# Altium schematic sheet C40_IMB_2nd level_block_diagram.SchDoc: C40 IMB BLOCK DIAGRAM 2
size 812 x 571 mm; DocumentNumber: 3; SheetNumber: 3; SheetTotal: 7; PageSetup: Record=PageOptions|CenterHorizontal=True|CenterVertical=True|PrintScale=0.48|XCorrection=1.00|YCorrection=1.00|PrintKind=0|BorderSize=5000000|LeftOffset=0|BottomOffset=0|Orientation=2|PaperLength=1000|PaperWidth=1000|Scale=100|PaperSource=15|PrintQuality=1200|MediaType=1|DitherType=10|PaperKind=11 x 17|PrintScaleMode=1
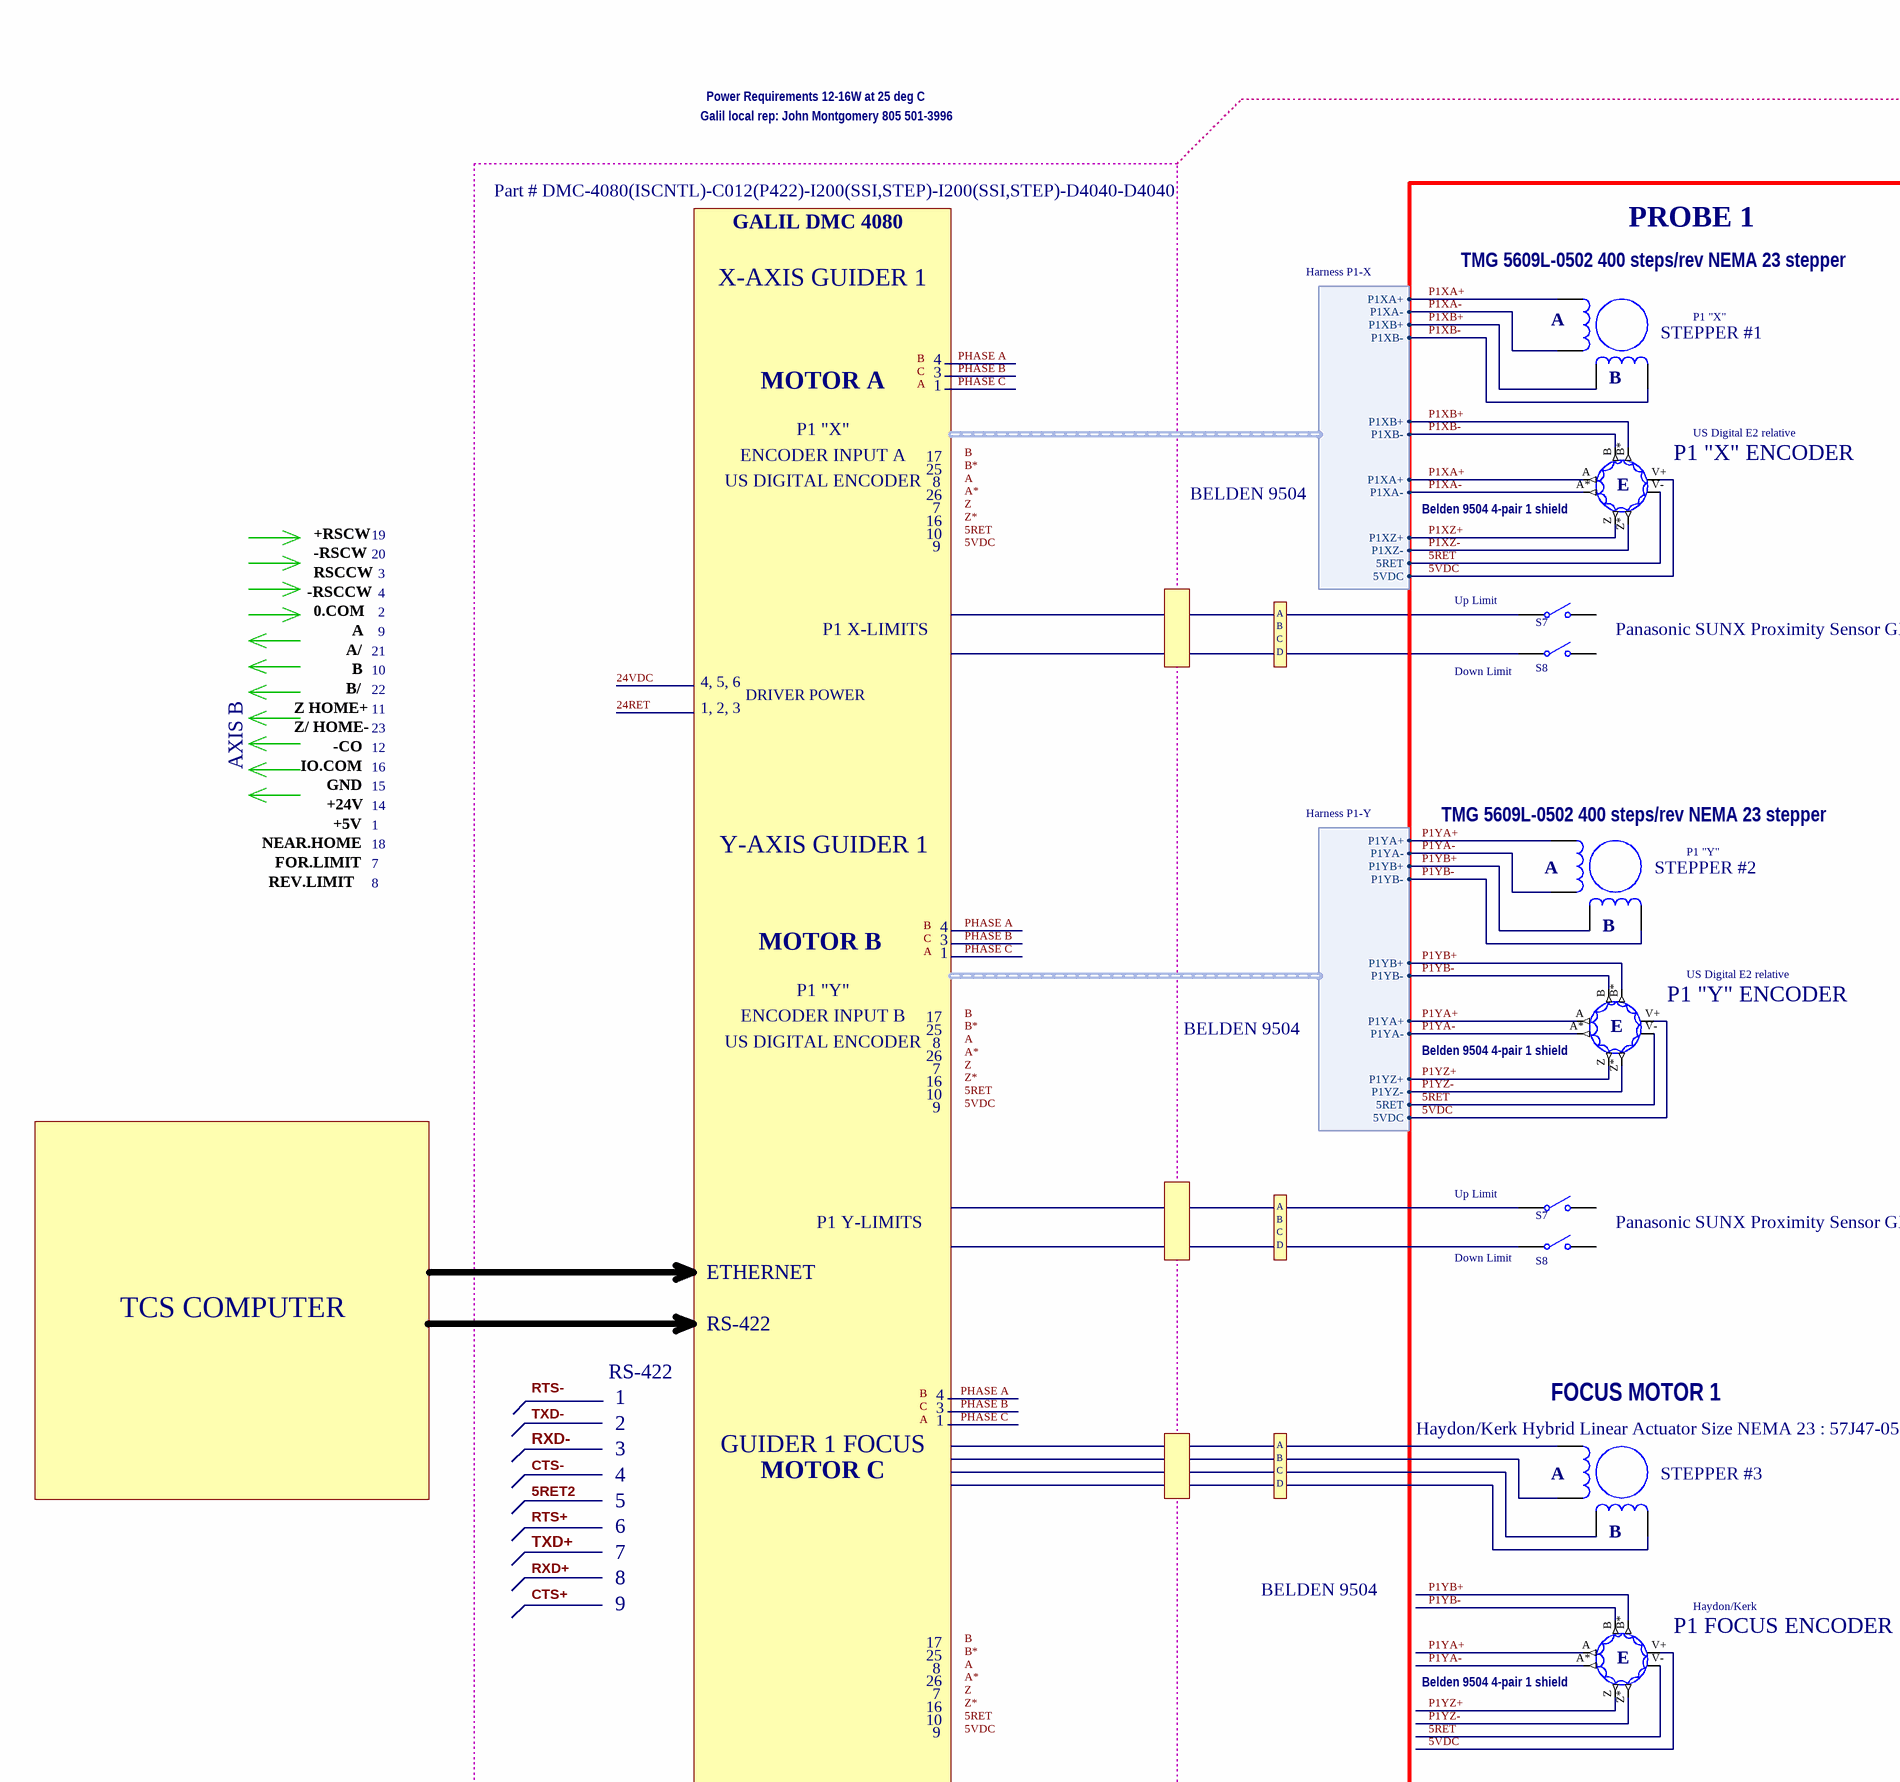
[diagram p0: C40_IMB_2nd level_block_diagram.SchDoc, top left]
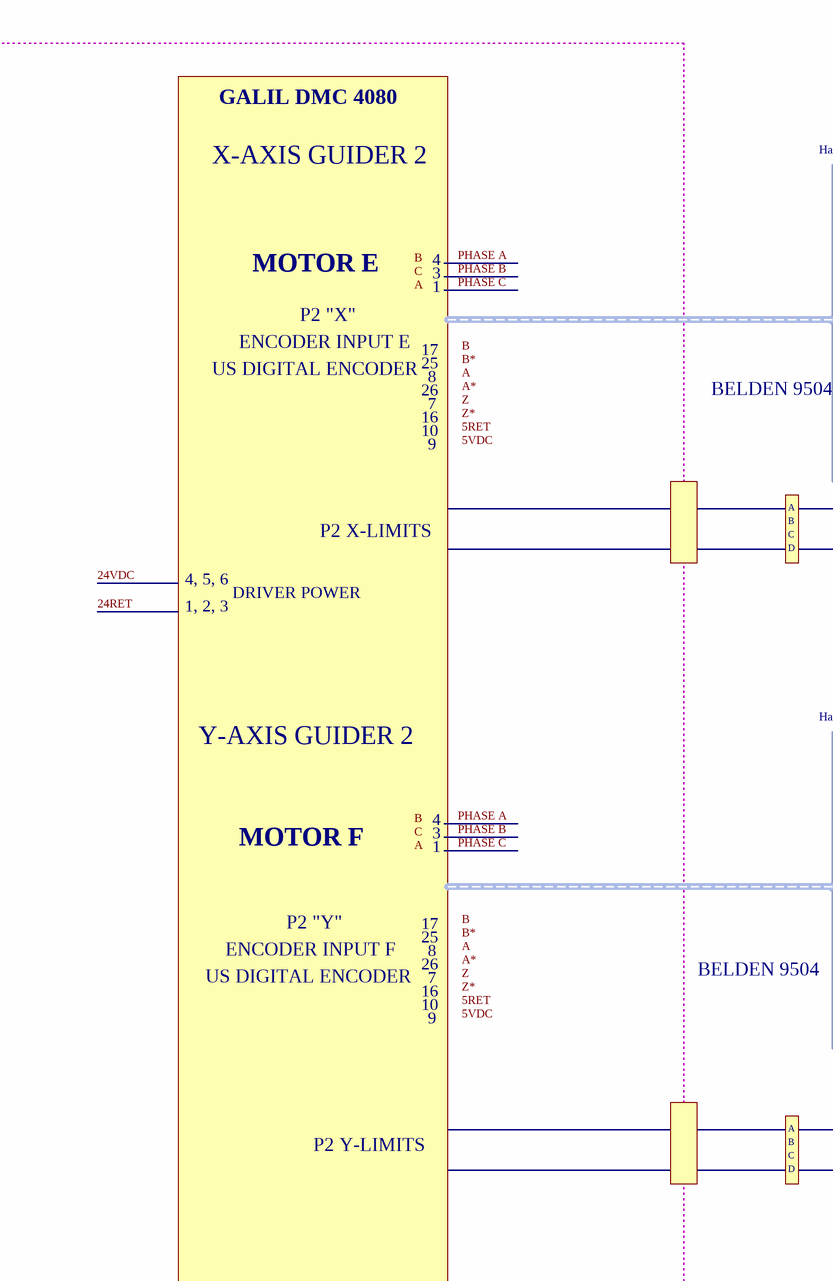
[diagram p1: C40_IMB_2nd level_block_diagram.SchDoc, top middle]
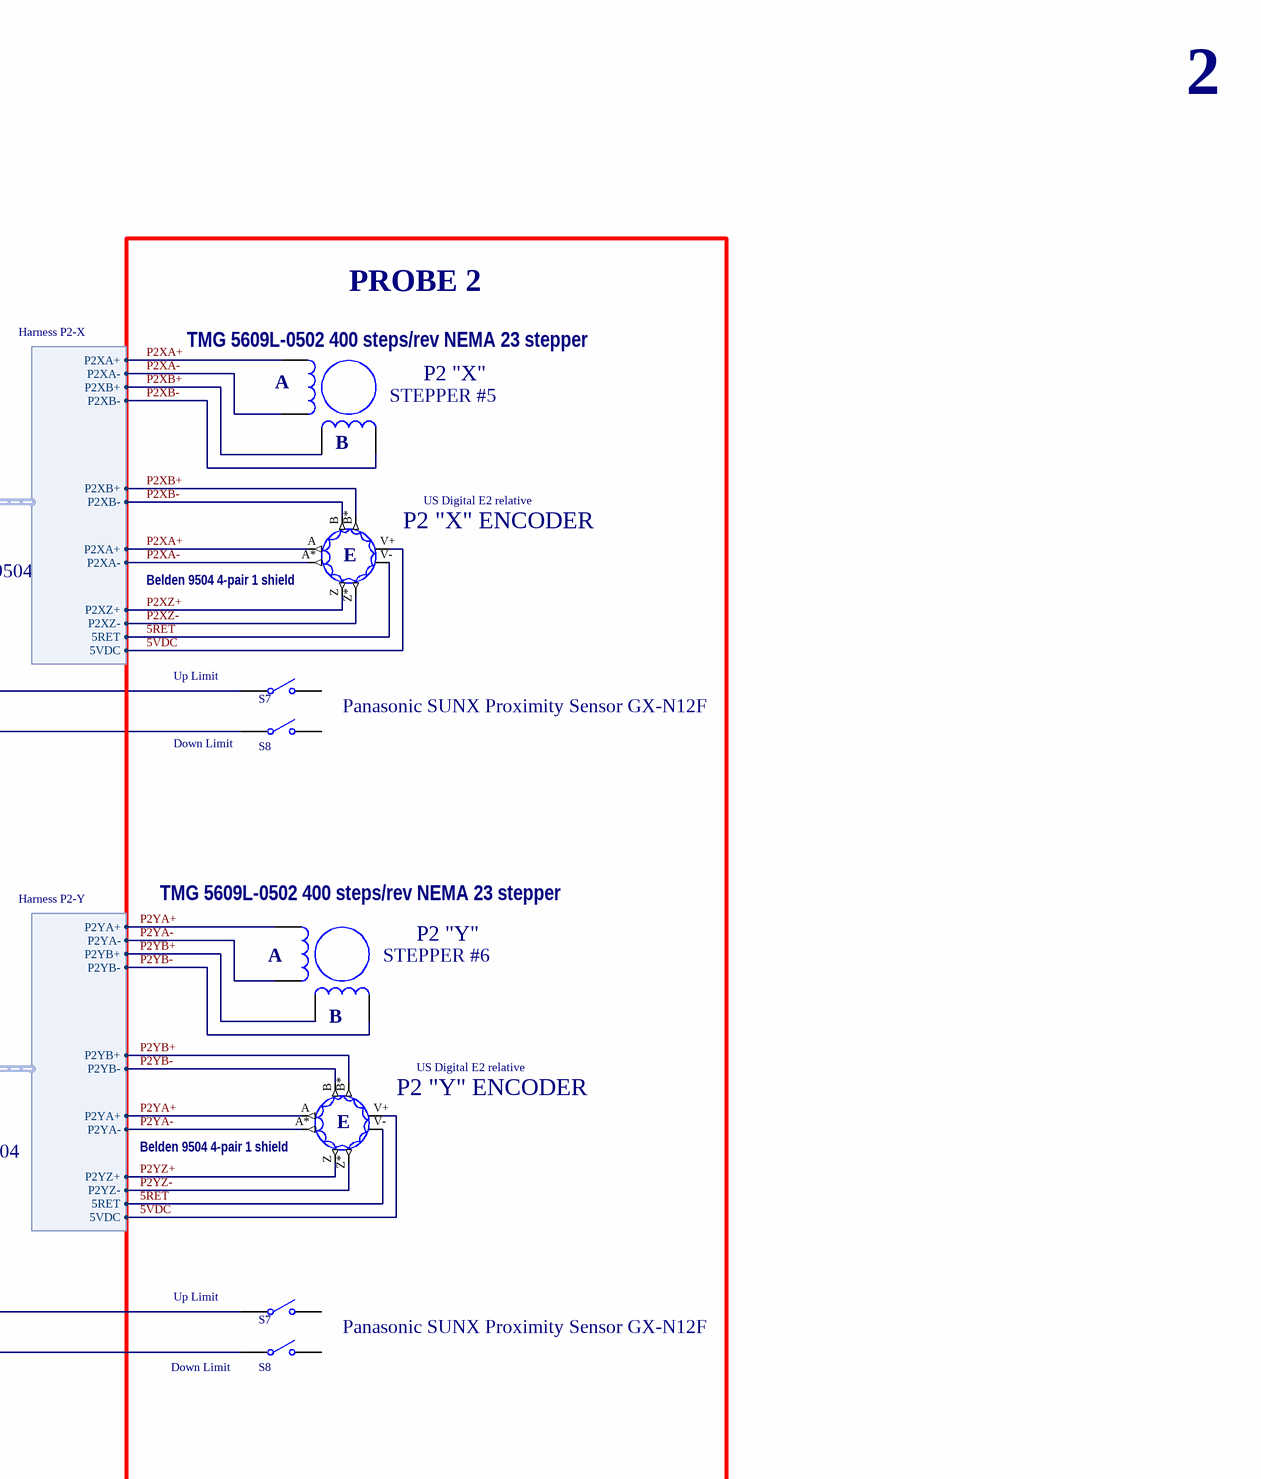
[diagram p2: C40_IMB_2nd level_block_diagram.SchDoc, top right]
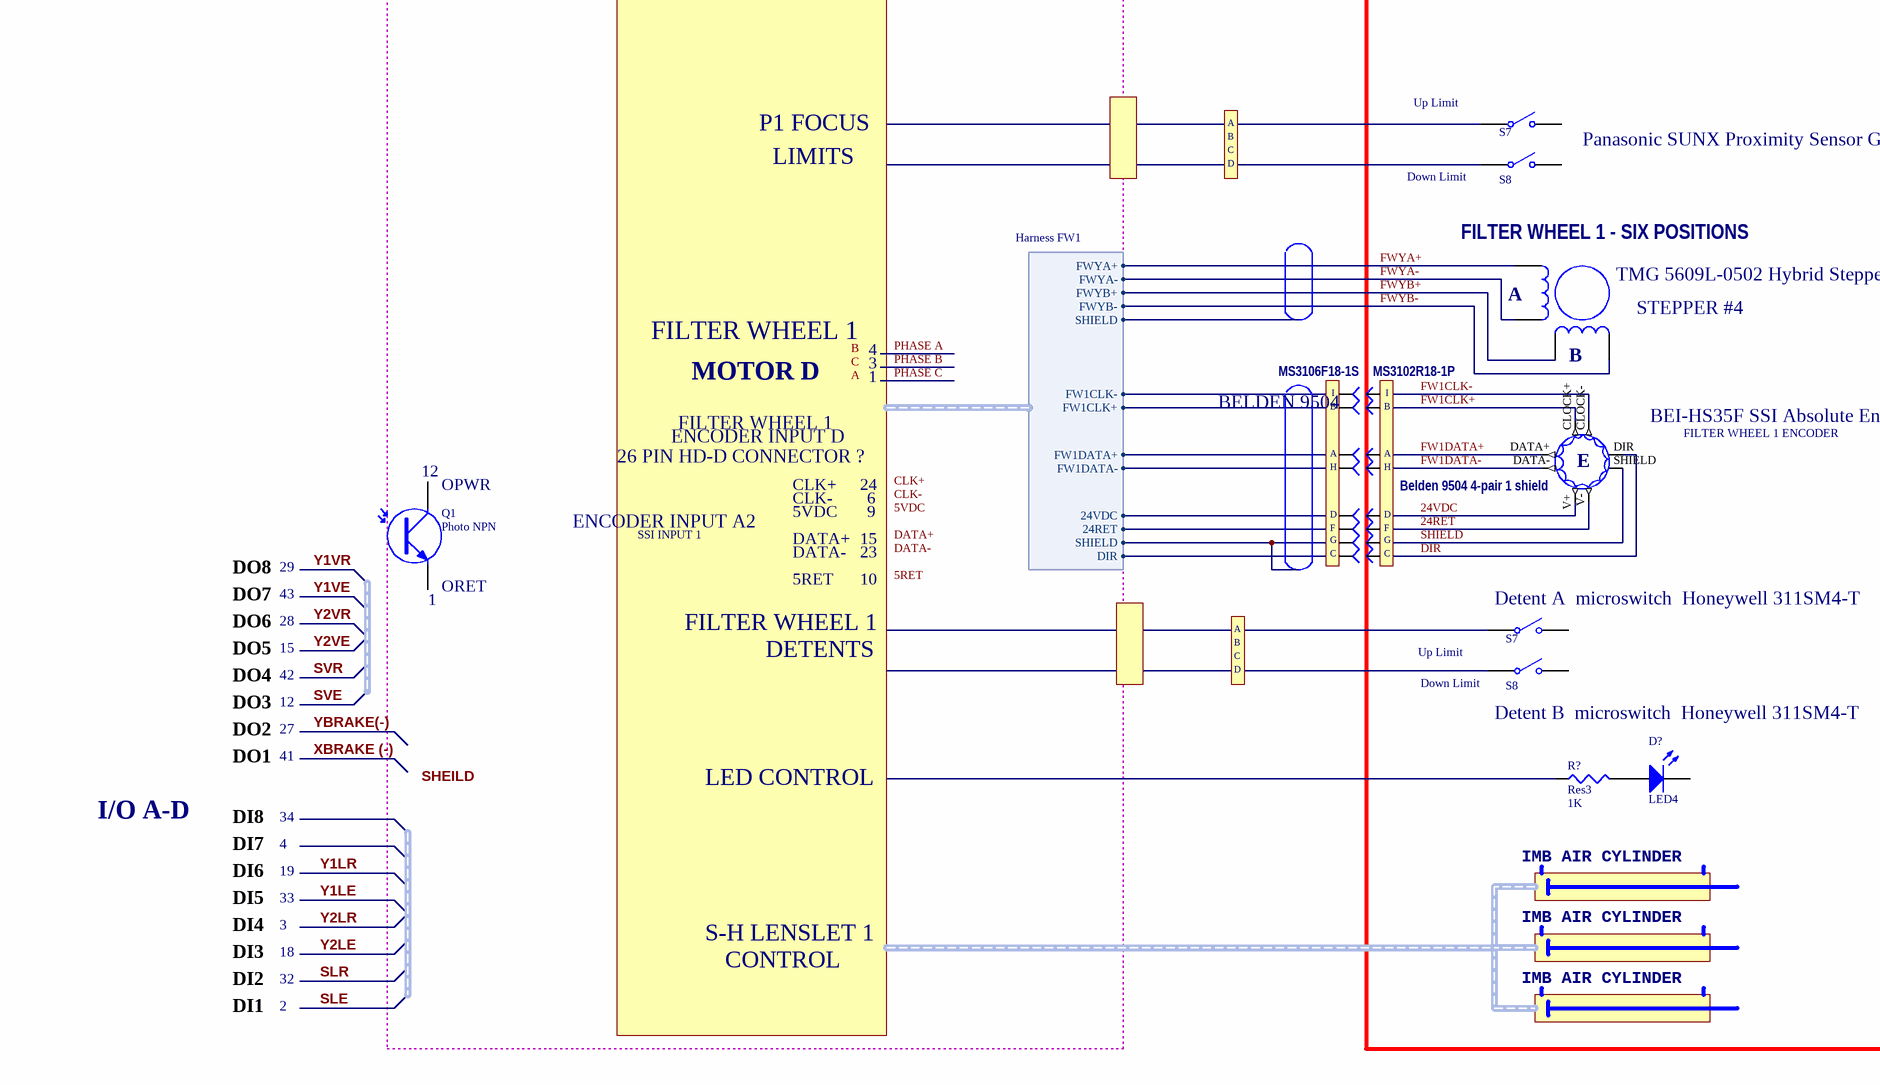
[diagram p3: C40_IMB_2nd level_block_diagram.SchDoc, bottom left]
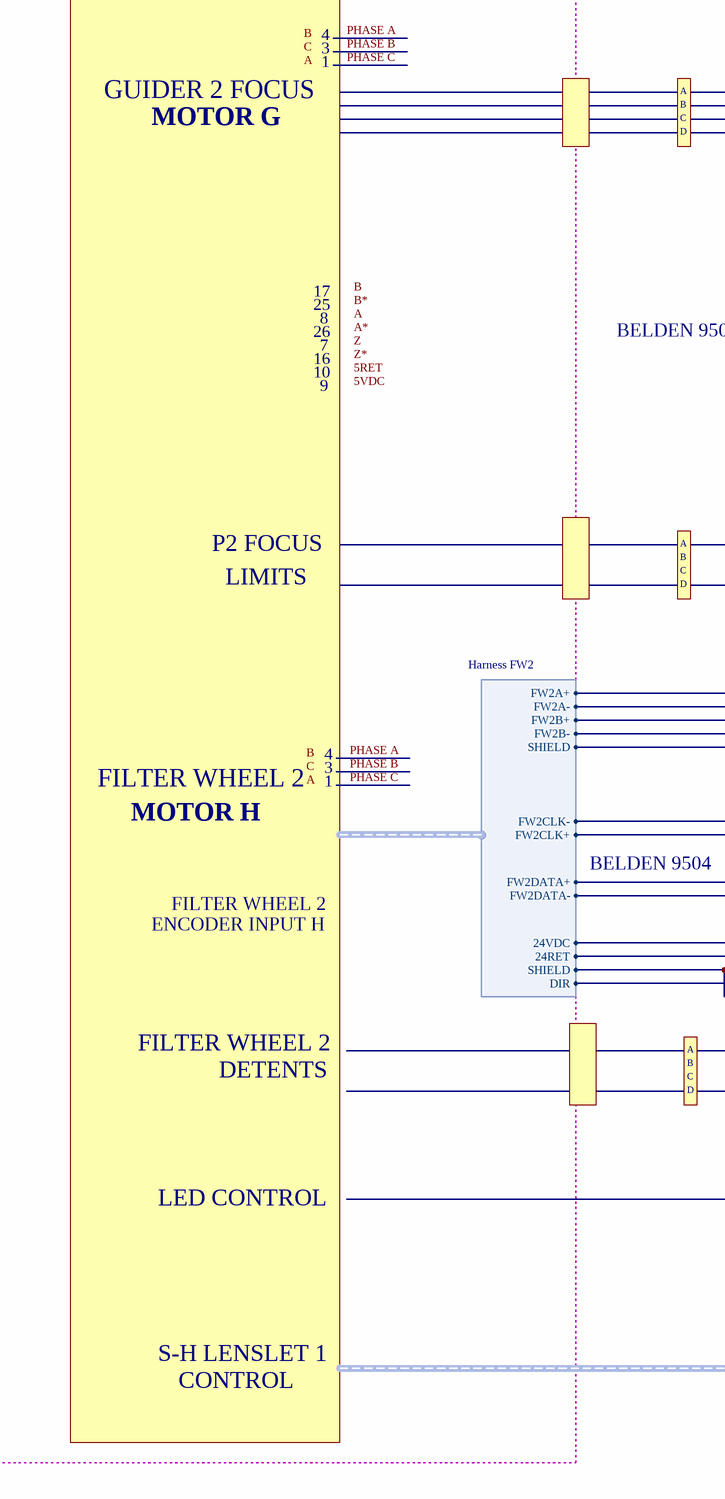
[diagram p4: C40_IMB_2nd level_block_diagram.SchDoc, bottom middle]
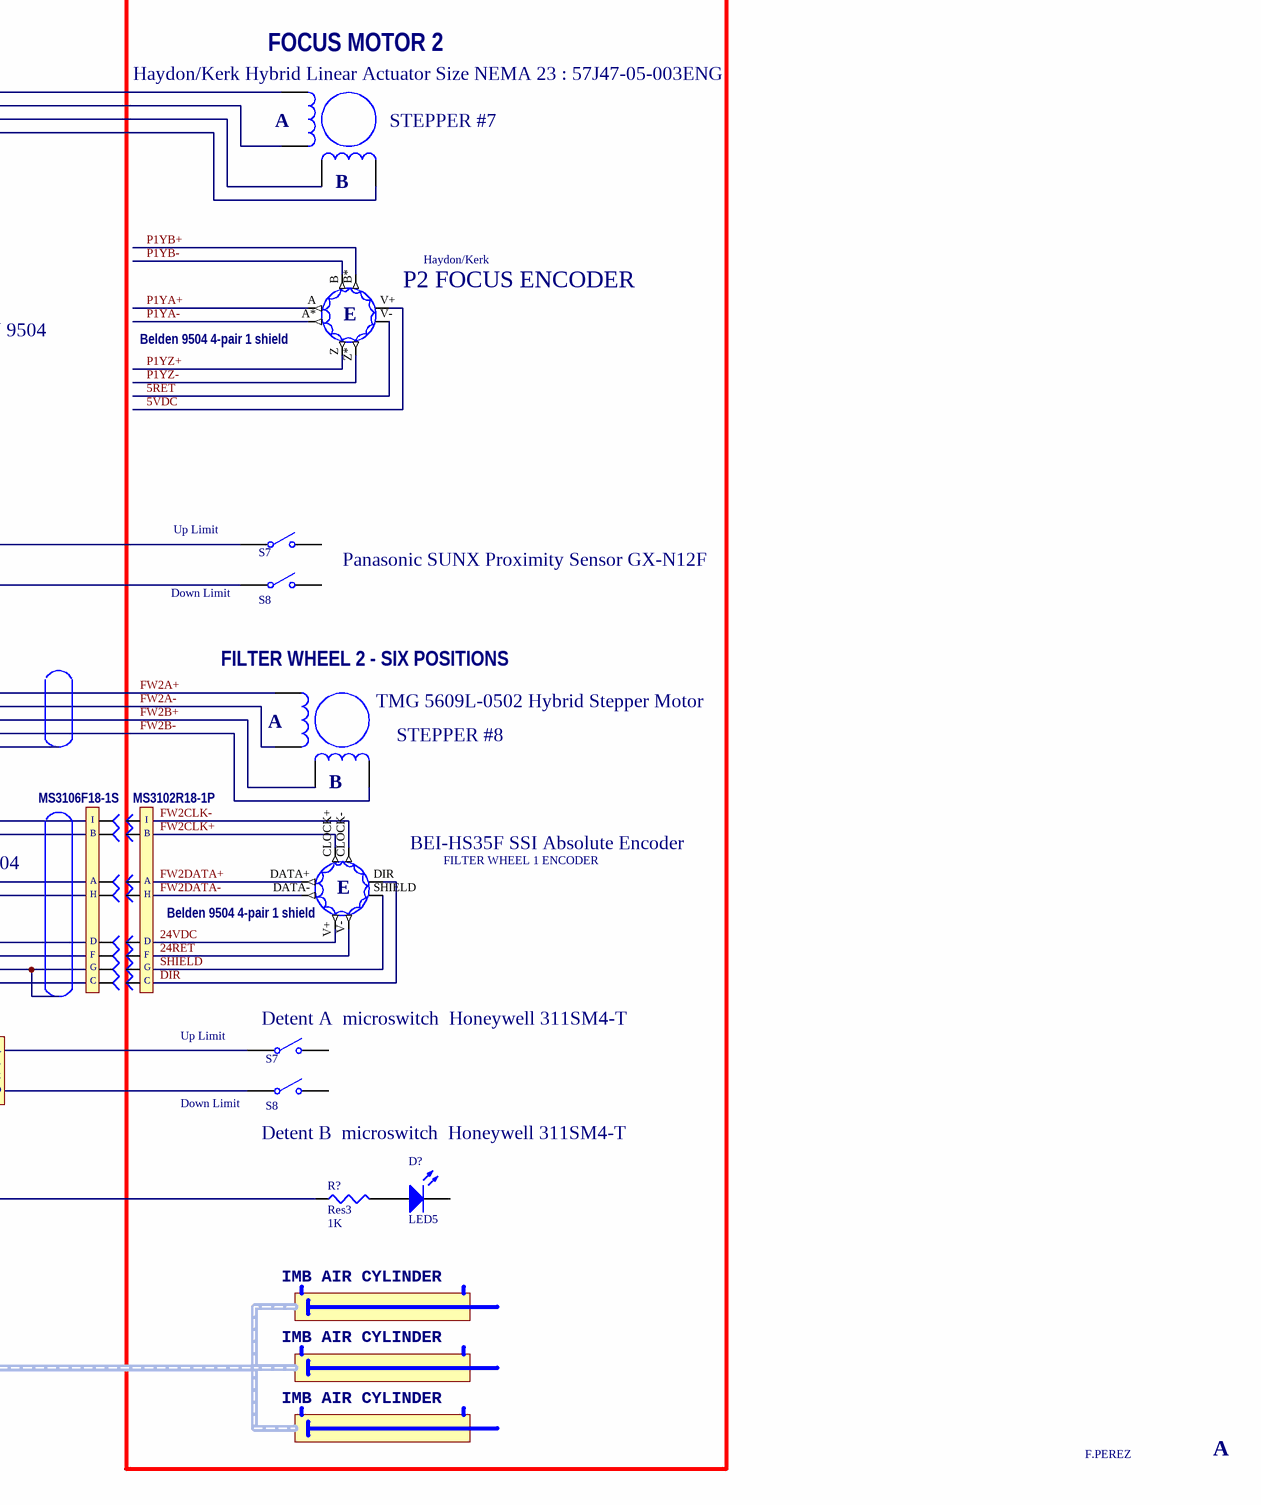
[diagram p5: C40_IMB_2nd level_block_diagram.SchDoc, bottom right]

## Parts
(Parts that share a designator on the sheet are numbered #1, #2 ... from top to bottom, then left to right.)
?#1  (no value)
?#2  (no value)
?#3  (no value)
?#4  (no value)
?#5  (no value)
?#6  (no value)
?#7  (no value)
?#8  (no value)
?#9  (no value)
?#10  (no value)
?#11  (no value)
?#12  (no value)
?#13  (no value)
?#14  (no value)
?#15  (no value)
?#16  (no value)
B#1  (no value)
B#2  (no value)
B#3  (no value)
B#4  (no value)
B#5  (no value)
B#6  (no value)
B#7  (no value)
B#8  (no value)
B#9  (no value)
B#10  (no value)
B#11  (no value)
B#12  (no value)
B#13  (no value)
B#14  (no value)
B#15  (no value)
B#16  (no value)
BEI-HS35F_SSI_Absolute_Encoder#1  FILTER WHEEL 1 ENCODER
BEI-HS35F_SSI_Absolute_Encoder#2  FILTER WHEEL 1 ENCODER
D?#1  LED4  [LED-1]
D?#2  LED5  [LED-1]
Haydon/Kerk#1  P1 FOCUS ENCODER
Haydon/Kerk#2  P2 FOCUS ENCODER
Haydon/Kerk_Hybrid_Linear_Actuator_Size_NEMA_23_:_57J47-05-003ENG#1  STEPPER #3
Haydon/Kerk_Hybrid_Linear_Actuator_Size_NEMA_23_:_57J47-05-003ENG#2  STEPPER #7
IMB_AIR_CYLINDER#1  (no value)
IMB_AIR_CYLINDER#2  (no value)
IMB_AIR_CYLINDER#3  (no value)
IMB_AIR_CYLINDER#4  (no value)
IMB_AIR_CYLINDER#5  (no value)
IMB_AIR_CYLINDER#6  (no value)
P1_"X"  STEPPER #1
P1_"Y"  STEPPER #2
P2_"X"  STEPPER #5
P2_"Y"  STEPPER #6
Q1  Photo NPN  [SFM-T2(3)/X1.6V]
R?#1  Res3  value 1K  [J1-0603]
R?#2  Res3  value 1K  [J1-0603]
S7#1  Up Limit  [SPST-2]
S7#2  Up Limit  [SPST-2]
S7#3  Up Limit  [SPST-2]
S7#4  Up Limit  [SPST-2]
S7#5  Up Limit  [SPST-2]
S7#6  Up Limit  [SPST-2]
S7#7  Up Limit  [SPST-2]
S7#8  Up Limit  [SPST-2]
S8#1  Down Limit  [SPST-2]
S8#2  Down Limit  [SPST-2]
S8#3  Down Limit  [SPST-2]
S8#4  Down Limit  [SPST-2]
S8#5  Down Limit  [SPST-2]
S8#6  Down Limit  [SPST-2]
S8#7  Down Limit  [SPST-2]
S8#8  Down Limit  [SPST-2]
TMG_5609L-0502_Hybrid_Stepper_Motor#1  STEPPER #4
TMG_5609L-0502_Hybrid_Stepper_Motor#2  STEPPER #8
US_Digital_E2_relative#1  P1 "X" ENCODER
US_Digital_E2_relative#2  P2 "X" ENCODER
US_Digital_E2_relative#3  P1 "Y" ENCODER
US_Digital_E2_relative#4  P2 "Y" ENCODER

## Blocks framed on the sheet
PROBE 1: B#1 B#3 B#5 B#7 B#9 B#11 B#13 B#15 BEI-HS35F_SSI_Absolute_Encoder#1 D?#1 Haydon/Kerk#1 Haydon/Kerk_Hybrid_Linear_Actuator_Size_NEMA_23_:_57J47-05-003ENG#1 IMB_AIR_CYLINDER#1 IMB_AIR_CYLINDER#3 IMB_AIR_CYLINDER#5 P1_"X" P1_"Y" R?#1 S7#1 S7#3 S7#5 S7#7 S8#1 S8#3 S8#5 S8#7 TMG_5609L-0502_Hybrid_Stepper_Motor#1 US_Digital_E2_relative#1 US_Digital_E2_relative#3
PROBE 2: B#2 B#4 B#6 B#8 B#10 B#12 B#14 B#16 BEI-HS35F_SSI_Absolute_Encoder#2 D?#2 Haydon/Kerk#2 Haydon/Kerk_Hybrid_Linear_Actuator_Size_NEMA_23_:_57J47-05-003ENG#2 IMB_AIR_CYLINDER#2 IMB_AIR_CYLINDER#4 IMB_AIR_CYLINDER#6 P2_"X" P2_"Y" R?#2 S7#2 S7#4 S7#6 S7#8 S8#2 S8#4 S8#6 S8#8 TMG_5609L-0502_Hybrid_Stepper_Motor#2 US_Digital_E2_relative#2 US_Digital_E2_relative#4

## Harnesses
Harness P1-X: P1XA+, P1XA-, P1XB+, P1XB-, P1XB+, P1XB-, P1XA+, P1XA-, P1XZ+, P1XZ-, 5RET, 5VDC
Harness P1-Y: P1YA+, P1YA-, P1YB+, P1YB-, P1YB+, P1YB-, P1YA+, P1YA-, P1YZ+, P1YZ-, 5RET, 5VDC
Harness P2-X: P2XA+, P2XA-, P2XB+, P2XB-, P2XB+, P2XB-, P2XA+, P2XA-, P2XZ+, P2XZ-, 5RET, 5VDC
Harness P2-Y: P2YA+, P2YA-, P2YB+, P2YB-, P2YB+, P2YB-, P2YA+, P2YA-, P2YZ+, P2YZ-, 5RET, 5VDC
Harness FW1: FWYA+, FWYA-, FWYB+, FWYB-, FW1CLK-, FW1CLK+, FW1DATA+, FW1DATA-, 24VDC, 24RET, SHIELD, DIR, SHIELD
Harness FW2: FW2A+, FW2A-, FW2B+, FW2B-, FW2CLK-, FW2CLK+, FW2DATA+, FW2DATA-, 24VDC, 24RET, SHIELD, DIR, SHIELD

## Nets
5RET: Haydon/Kerk#1.V- Haydon/Kerk#2.V- US_Digital_E2_relative#1.V- US_Digital_E2_relative#2.V- US_Digital_E2_relative#3.V- US_Digital_E2_relative#4.V- ; harness Harness P1-X.5RET, harness Harness P1-Y.5RET, harness Harness P2-X.5RET, harness Harness P2-Y.5RET
5VDC: Haydon/Kerk#1.V+ Haydon/Kerk#2.V+ US_Digital_E2_relative#1.V+ US_Digital_E2_relative#2.V+ US_Digital_E2_relative#3.V+ US_Digital_E2_relative#4.V+ ; harness Harness P1-X.5VDC, harness Harness P1-Y.5VDC, harness Harness P2-X.5VDC, harness Harness P2-Y.5VDC
24RET: B#11.?1 B#12.?1 BEI-HS35F_SSI_Absolute_Encoder#1.V- BEI-HS35F_SSI_Absolute_Encoder#2.V-
24VDC: B#9.?1 B#10.?1 BEI-HS35F_SSI_Absolute_Encoder#1.V+ BEI-HS35F_SSI_Absolute_Encoder#2.V+
DIR: B#15.?1 B#16.?1 BEI-HS35F_SSI_Absolute_Encoder#1.DIR BEI-HS35F_SSI_Absolute_Encoder#2.DIR
FW1CLK+: B#3.?1 BEI-HS35F_SSI_Absolute_Encoder#1.CLOCK+
FW1CLK-: BEI-HS35F_SSI_Absolute_Encoder#1.CLOCK-
FW1DATA+: B#5.?1 BEI-HS35F_SSI_Absolute_Encoder#1.DATA+
FW1DATA-: B#7.?1 BEI-HS35F_SSI_Absolute_Encoder#1.DATA-
FW2A+: TMG_5609L-0502_Hybrid_Stepper_Motor#2.1 ; harness Harness FW2.FW2A+
FW2A-: TMG_5609L-0502_Hybrid_Stepper_Motor#2.3 ; harness Harness FW2.FW2A-
FW2B+: TMG_5609L-0502_Hybrid_Stepper_Motor#2.4 ; harness Harness FW2.FW2B+
FW2B-: TMG_5609L-0502_Hybrid_Stepper_Motor#2.6 ; harness Harness FW2.FW2B-
FW2CLK+: B#4.?1 BEI-HS35F_SSI_Absolute_Encoder#2.CLOCK+
FW2CLK-: BEI-HS35F_SSI_Absolute_Encoder#2.CLOCK-
FW2DATA+: B#6.?1 BEI-HS35F_SSI_Absolute_Encoder#2.DATA+
FW2DATA-: B#8.?1 BEI-HS35F_SSI_Absolute_Encoder#2.DATA-
FWYA+: TMG_5609L-0502_Hybrid_Stepper_Motor#1.1 ; harness Harness FW1.FWYA+
FWYA-: TMG_5609L-0502_Hybrid_Stepper_Motor#1.3 ; harness Harness FW1.FWYA-
FWYB+: TMG_5609L-0502_Hybrid_Stepper_Motor#1.4 ; harness Harness FW1.FWYB+
FWYB-: TMG_5609L-0502_Hybrid_Stepper_Motor#1.6 ; harness Harness FW1.FWYB-
P1XA+: P1_"X".1 US_Digital_E2_relative#1.A ; harness Harness P1-X.P1XA+
P1XA-: P1_"X".3 US_Digital_E2_relative#1.A* ; harness Harness P1-X.P1XA-
P1XB+: P1_"X".4 US_Digital_E2_relative#1.B* ; harness Harness P1-X.P1XB+
P1XB-: P1_"X".6 US_Digital_E2_relative#1.B ; harness Harness P1-X.P1XB-
P1XZ+: US_Digital_E2_relative#1.Z ; harness Harness P1-X.P1XZ+
P1XZ-: US_Digital_E2_relative#1.Z* ; harness Harness P1-X.P1XZ-
P1YA+: Haydon/Kerk#1.A Haydon/Kerk#2.A P1_"Y".1 US_Digital_E2_relative#3.A ; harness Harness P1-Y.P1YA+
P1YA-: Haydon/Kerk#1.A* Haydon/Kerk#2.A* P1_"Y".3 US_Digital_E2_relative#3.A* ; harness Harness P1-Y.P1YA-
P1YB+: Haydon/Kerk#1.B* Haydon/Kerk#2.B* P1_"Y".4 US_Digital_E2_relative#3.B* ; harness Harness P1-Y.P1YB+
P1YB-: Haydon/Kerk#1.B Haydon/Kerk#2.B P1_"Y".6 US_Digital_E2_relative#3.B ; harness Harness P1-Y.P1YB-
P1YZ+: Haydon/Kerk#1.Z Haydon/Kerk#2.Z US_Digital_E2_relative#3.Z ; harness Harness P1-Y.P1YZ+
P1YZ-: Haydon/Kerk#1.Z* Haydon/Kerk#2.Z* US_Digital_E2_relative#3.Z* ; harness Harness P1-Y.P1YZ-
P2XA+: P2_"X".1 US_Digital_E2_relative#2.A ; harness Harness P2-X.P2XA+
P2XA-: P2_"X".3 US_Digital_E2_relative#2.A* ; harness Harness P2-X.P2XA-
P2XB+: P2_"X".4 US_Digital_E2_relative#2.B* ; harness Harness P2-X.P2XB+
P2XB-: P2_"X".6 US_Digital_E2_relative#2.B ; harness Harness P2-X.P2XB-
P2XZ+: US_Digital_E2_relative#2.Z ; harness Harness P2-X.P2XZ+
P2XZ-: US_Digital_E2_relative#2.Z* ; harness Harness P2-X.P2XZ-
P2YA+: P2_"Y".1 US_Digital_E2_relative#4.A ; harness Harness P2-Y.P2YA+
P2YA-: P2_"Y".3 US_Digital_E2_relative#4.A* ; harness Harness P2-Y.P2YA-
P2YB+: P2_"Y".4 US_Digital_E2_relative#4.B* ; harness Harness P2-Y.P2YB+
P2YB-: P2_"Y".6 US_Digital_E2_relative#4.B ; harness Harness P2-Y.P2YB-
P2YZ+: US_Digital_E2_relative#4.Z ; harness Harness P2-Y.P2YZ+
P2YZ-: US_Digital_E2_relative#4.Z* ; harness Harness P2-Y.P2YZ-
SHIELD: B#13.?1 B#14.?1 BEI-HS35F_SSI_Absolute_Encoder#1.SHIELD BEI-HS35F_SSI_Absolute_Encoder#2.SHIELD
NetD?#1_1: D?#1.1(A) R?#1.2
NetD?#2_1: D?#2.1(A) R?#2.2

Not connected (* = marked no-connect by the designer): ?#1 ?1; ?#2 ?1; ?#3 ?1; ?#4 ?1; ?#5 ?1; ?#6 ?1; ?#7 ?1; ?#8 ?1; ?#9 ?1; ?#10 ?1; ?#11 ?1; ?#12 ?1; ?#13 ?1; ?#14 ?1; ?#15 ?1; ?#16 ?1; B#1 ?1; B#2 ?1; D?#1 2(K); D?#2 2(K); Haydon/Kerk_Hybrid_Linear_Actuator_Size_NEMA_23_:_57J47-05-003ENG#1 1 3 4 6; Haydon/Kerk_Hybrid_Linear_Actuator_Size_NEMA_23_:_57J47-05-003ENG#2 1 3 4 6; Q1 1(C) 3(E); R?#1 1; R?#2 1; S7#1 1(COMMON) 2(NO); S7#2 1(COMMON) 2(NO); S7#3 1(COMMON) 2(NO); S7#4 1(COMMON) 2(NO); S7#5 1(COMMON) 2(NO); S7#6 1(COMMON) 2(NO); S7#7 1(COMMON) 2(NO); S7#8 1(COMMON) 2(NO); S8#1 1(COMMON) 2(NO); S8#2 1(COMMON) 2(NO); S8#3 1(COMMON) 2(NO); S8#4 1(COMMON) 2(NO); S8#5 1(COMMON) 2(NO); S8#6 1(COMMON) 2(NO); S8#7 1(COMMON) 2(NO); S8#8 1(COMMON) 2(NO)

## Notes on the sheet
- 2
- Galil local rep: John Montgomery 805 501-3996
- Power Requirements 12-16W at 25 deg C
- Full hardware handshaking required for Galil controller
- Part # DMC-4080(ISCNTL)-C012(P422)-I200(SSI,STEP)-I200(SSI,STEP)-D4040-D4040
- GALIL DMC 4080
- (near P1_"X") TMG 5609L-0502 400 steps/rev NEMA 23 stepper
- X-AXIS GUIDER 1
- (near P1_"X") A
- X-AXIS GUIDER 2
- (near P2_"X") TMG 5609L-0502 400 steps/rev NEMA 23 stepper
- (near P2_"X") A
- MOTOR A
- 4
- 1
- 3
- (near P1_"X") B
- MOTOR E
- (near P2_"X") B
- ENCODER INPUT A
- P1 "X"
- 17
- ENCODER INPUT E
- P2 "X"
- US DIGITAL ENCODER
- 25
- 26
- 16
- 8
- 7
- BELDEN 9504
- (near US_Digital_E2_relative#1) Belden 9504 4-pair 1 shield
- (near US_Digital_E2_relative#2) Belden 9504 4-pair 1 shield
- RSCCW
- -RSCW
- +RSCW
- 20
- 19
- 10
- 9
- -RSCCW
- 0.COM
- A/
- A
- 21
- P1 X-LIMITS
- D
- C
- B
- Panasonic SUNX Proximity Sensor GX-N12F
- P2 X-LIMITS
- Z HOME+
- B/
- 22
- 11
- 1, 2, 3
- 4, 5, 6
- DRIVER POWER
- AXIS B
- Z/ HOME-
- IO.COM
- GND
- -CO
- 23
- 12
- 15
- NEAR.HOME
- +24V
- +5V
- 14
- 18
- (near P1_"Y") TMG 5609L-0502 400 steps/rev NEMA 23 stepper
- Y-AXIS GUIDER 2
- (near P2_"Y") TMG 5609L-0502 400 steps/rev NEMA 23 stepper
- REV.LIMIT
- FOR.LIMIT
- Y-AXIS GUIDER 1
- (near P1_"Y") A
- (near P2_"Y") A
- MOTOR B
- (near P1_"Y") B
- MOTOR F
- (near P2_"Y") B
- ENCODER INPUT B
- P1 "Y"
- ENCODER INPUT F
- P2 "Y"
- (near US_Digital_E2_relative#3) Belden 9504 4-pair 1 shield
- (near US_Digital_E2_relative#4) Belden 9504 4-pair 1 shield
- P1 Y-LIMITS
- P2 Y-LIMITS
- ETHERNET
- TCS COMPUTER
- RS-422
- (near Haydon/Kerk_Hybrid_Linear_Actuator_Size_NEMA_23_:_57J47-05-003ENG#1) FOCUS MOTOR 1
- (near Haydon/Kerk_Hybrid_Linear_Actuator_Size_NEMA_23_:_57J47-05-003ENG#2) FOCUS MOTOR 2
- GUIDER 1 FOCUS
- MOTOR C
- (near Haydon/Kerk_Hybrid_Linear_Actuator_Size_NEMA_23_:_57J47-05-003ENG#1) A
- GUIDER 2 FOCUS
- MOTOR G
- (near Haydon/Kerk_Hybrid_Linear_Actuator_Size_NEMA_23_:_57J47-05-003ENG#2) A
- 5
- 6
- (near Haydon/Kerk_Hybrid_Linear_Actuator_Size_NEMA_23_:_57J47-05-003ENG#1) B
- (near Haydon/Kerk_Hybrid_Linear_Actuator_Size_NEMA_23_:_57J47-05-003ENG#2) B
- (near Haydon/Kerk#1) Belden 9504 4-pair 1 shield
- (near Haydon/Kerk#2) Belden 9504 4-pair 1 shield
- P1 FOCUS
- LIMITS
- P2 FOCUS
- (near TMG_5609L-0502_Hybrid_Stepper_Motor#1) FILTER WHEEL 1 - SIX POSITIONS
- (near TMG_5609L-0502_Hybrid_Stepper_Motor#2) FILTER WHEEL 2 - SIX POSITIONS
- (near TMG_5609L-0502_Hybrid_Stepper_Motor#1) A
- (near TMG_5609L-0502_Hybrid_Stepper_Motor#2) A
- FILTER WHEEL 1
- MOTOR D
- (near B#1) MS3106F18-1S
- (near B#1) I
- (near B#1) MS3102R18-1P
- (near TMG_5609L-0502_Hybrid_Stepper_Motor#1) B
- FILTER WHEEL 2
- (near B#2) MS3106F18-1S
- (near B#2) I
- (near B#2) MS3102R18-1P
- (near TMG_5609L-0502_Hybrid_Stepper_Motor#2) B
- 26 PIN HD-D CONNECTOR ?
- ENCODER INPUT D
- (near B#1) BELDEN 9504
- (near B#3) B
- (near B#5) A
- (near B#7) H
- MOTOR H
- (near B#4) B
- (near B#6) A
- (near Q1) 12
- (near Q1) OPWR
- ENCODER INPUT A2
- CLK+
- CLK-
- 5VDC
- 24
- (near B#9) D
- (near B#11) F
- (near BEI-HS35F_SSI_Absolute_Encoder#1) Belden 9504 4-pair 1 shield
- ENCODER INPUT H
- (near B#10) D
- (near B#12) F
- (near B#8) H
- (near BEI-HS35F_SSI_Absolute_Encoder#2) Belden 9504 4-pair 1 shield
- DO7
- DO8
- 43
- 29
- (near Q1) 1
- (near Q1) ORET
- SSI INPUT 1
- DATA+
- DATA-
- 5RET
- (near B#15) C
- (near B#13) G
- (near S7#7) Detent A  microswitch  Honeywell 311SM4-T
- (near B#16) C
- (near B#14) G
- (near S7#8) Detent A  microswitch  Honeywell 311SM4-T
- DO5
- DO6
- 28
- DETENTS
- DO2
- DO3
- DO4
- 27
- 42
- (near S8#7) Detent B  microswitch  Honeywell 311SM4-T
- (near S8#8) Detent B  microswitch  Honeywell 311SM4-T
- DO1
- 41
- LED CONTROL
- I/O A-D
- DI7
- DI8
- 34
- DI4
- DI5
- DI6
- 33
- DI2
- DI3
- 32
- S-H LENSLET 1
- CONTROL
- DI1
- F.PEREZ
- Labels drawn without touching a wire or pin: 5RET, 5VDC, A, A*, B, B*, C, CLK+, CLK-, CTS+, DATA+, DATA-, RTS+, RTS-, SHEILD, Z, Z*
- Carnegie Institution of Washington
- Pasadena, California 91101
- 813 Santa Barbara Street
- The Observatories
- PHONE (626) 577-1122               FAX (626) 795-8136
- Title:
- OCIW
- Size:
- Date:
- File:
- Scale:
- Drawn By:
- Checked By:
- A. BAGISH
- alanb
- Revision:
- Sheet          of
- (in symbol ENCODER DIF) E
- (in symbol ENCODER SSI) E

## Library data of the parts
?#1-?#16 = SOCKET-DMC
B#1-B#16 = PLUG-DMC
BEI-HS35F_SSI_Absolute_Encoder#1 BEI-HS35F_SSI_Absolute_Encoder#2 = ENCODER SSI
D?#1 D?#2 = LED1: Typical RED GaAs LED; Published: 8-Jun-2000; LatestRevisionDate: 08-Jul-2005; LatestRevisionNote: Mech Layer 1 removed.; PackageReference: LED-1; Publisher: Altium Limited; PackageDescription: LED; 2 Leads
Haydon/Kerk#1 Haydon/Kerk#2 US_Digital_E2_relative#1-US_Digital_E2_relative#4 = ENCODER DIF
Haydon/Kerk_Hybrid_Linear_Actuator_Size_NEMA_23_:_57J47-05-003ENG#1 Haydon/Kerk_Hybrid_Linear_Actuator_Size_NEMA_23_:_57J47-05-003ENG#2 P1_"X" P1_"Y" P2_"X" P2_"Y" TMG_5609L-0502_Hybrid_Stepper_Motor#1 TMG_5609L-0502_Hybrid_Stepper_Motor#2 = MOTOR STEPPER
IMB_AIR_CYLINDER#1-IMB_AIR_CYLINDER#6 = AIR CYL LONG IN
Q1 = Photo NPN: NPN Phototransistor; Published: 24-Mar-1999; LatestRevisionDate: 17-Jul-2002; LatestRevisionNote: Re-released for DXP Platform.; PackageReference: TO-220_A; Publisher: Altium Limited; Code_JEDEC: TO-220-AC
R?#1 R?#2 = Res3: Resistor; Published: 8-Jun-2000; LatestRevisionDate: 29-May-2009; LatestRevisionNote: IPC-7351 Footprint Added.; PackageReference: J1-0603; Publisher: Altium Limited; PackageDescription: Chip Resistor
S7#1-S7#8 S8#1-S8#8 = SW-SPST: Single-Pole, Single-Throw Switch; Published: 24-Mar-1999; LatestRevisionDate: 17-Jul-2002; LatestRevisionNote: Re-released for DXP Platform.; Publisher: Altium Limited